# Altium schematic sheet MCU.SchDoc
size A3; Author: Ali Zoubir; Organization: ETML-ES; Address1: Avenue Recordon 1; Address2: 1004 Lausanne; Address3: Switzerland; Revision: 2221; SheetNumber: 2; SheetTotal: 6; SPICEModelCacheGNAZWADN: <root> / <DocumentId>GNAZWADN</DocumentId> / </root>; Version: V0
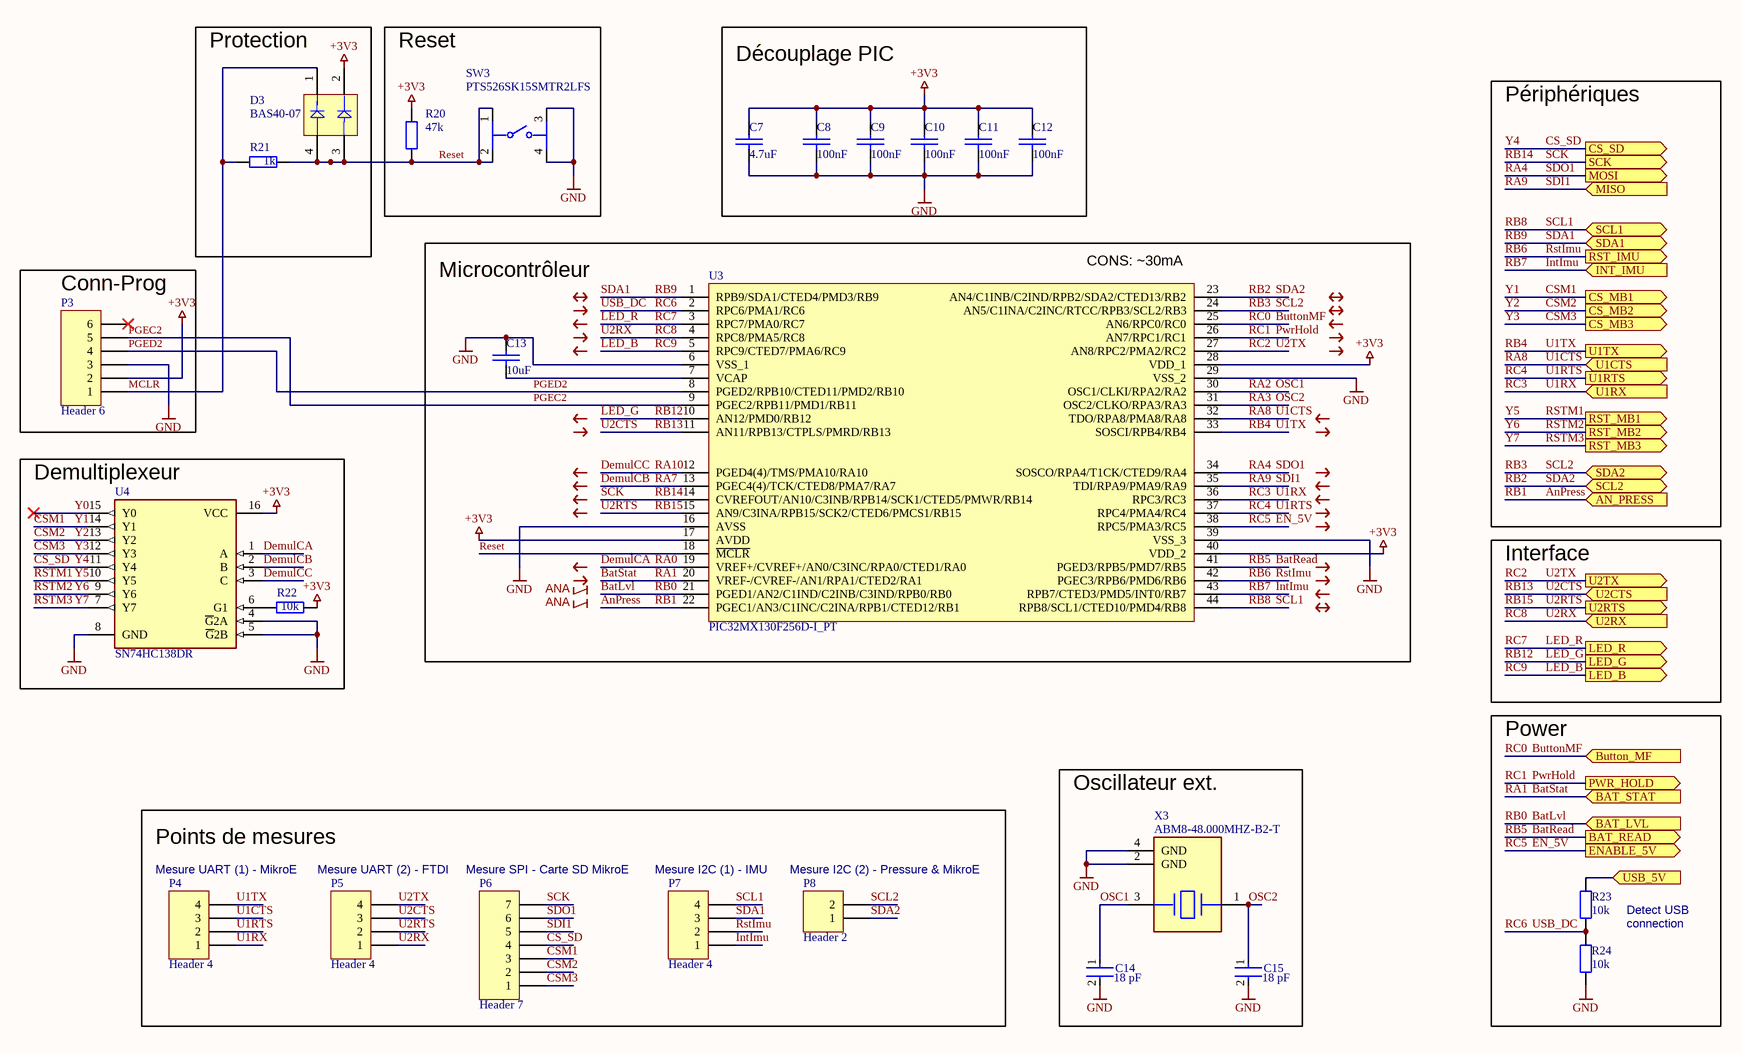
[diagram p0: MCU.SchDoc]

## Parts
C7  4.7uF  [6-0805_L]
C8  100nF  [6-0805_L]
C9  100nF  [6-0805_L]
C10  100nF  [6-0805_L]
C11  100nF  [6-0805_L]
C12  100nF  [6-0805_L]
C13  10uF  [6-0805_L]
C14  Capacitance: 18 pF  [FP-C0805C-DN-MFG]  (hidden comment: C0805C180J5GACTU)
C15  Capacitance: 18 pF  [FP-C0805C-DN-MFG]  (hidden comment: C0805C180J5GACTU)
D3  BAS40-07  [INF-SOT143_V]
P3  Header 6  [HDR1X6]
P4  Header 4  [HDR1X4]
P5  Header 4  [HDR1X4]
P6  Header 7  [HDR1X7]
P7  Header 4  [HDR1X4]
P8  Header 2  [HDR1X2]
R20  47k  [6-0805_L]
R21  1k  [6-0805_L]
R22  10k  [6-0805_L]
R23  10k  [6-0805_L]
R24  10k  [6-0805_L]
SW3  PTS526SK15SMTR2LFS  [FP-PTS526SK15SMTR2LFS-MFG]
U3  PIC32MX130F256D-I_PT  [QFP80P1200X1200X120-44N]
U4  SN74HC138DR  [FP-D0016A-IPC_A]
X3  ABM8-48.000MHZ-B2-T  [FP-ABM8-MFG]

## Blocks framed on the sheet
Protection: D3 R21
Reset: R20 SW3
Découplage PIC: C7-C12
Microcontrôleur: C13 U3
Conn-Prog: P3
Demultiplexeur: R22 U4
Power: R23 R24
Oscillateur ext.: C14 C15 X3
Points de mesures: P4-P8

## Ports
AN_PRESS (in), BAT_LVL (in), BAT_READ (out), BAT_STAT (in), Button_MF (in), CS_MB1 (out), CS_MB2 (out), CS_MB3 (out), CS_SD (out), ENABLE_5V (out), INT_IMU (in), LED_B (out), LED_G (out), LED_R (out), MISO (in), MOSI (out), PWR_HOLD (out), RST_IMU (out), RST_MB1 (out), RST_MB2 (out), RST_MB3 (out), SCK (out), SCL1 (bidir), SCL2 (bidir), SDA1 (bidir), SDA2 (bidir), U1CTS (in), U1RTS (out), U1RX (in), U1TX (out), U2CTS (in), U2RTS (out), U2RX (in), U2TX (out), USB_5V (in)

## Nets
+3V3: C7.1 C8.1 C9.1 C10.1 C11.1 C12.1 D3.2(K2) P3.2 R20.1 R22.2 U3.17(AVDD) U3.28(VDD_1) U3.40(VDD_2) U4.16(VCC)
GND: C7.2 C8.2 C9.2 C10.2 C11.2 C12.2 C13.1 C14.2 C15.2 P3.3 R24.1 SW3.3 SW3.4 U3.6(VSS_1) U3.16(AVSS) U3.29(VSS_2) U3.39(VSS_3) U4.4(~{G}2A) U4.5(~{G}2B) U4.8(GND) X3.2(GND) X3.4(GND)
AnPress: U3.22(PGEC1/AN3/C1INC/C2INA/RPB1/CTED12/RB1) ; port AN_PRESS  [also labelled RB1]
BatLvl: U3.21(PGED1/AN2/C1IND/C2INB/C3IND/RPB0/RB0) ; port BAT_LVL  [also labelled RB0]
BatRead: U3.41(PGED3/RPB5/PMD7/RB5) ; port BAT_READ  [also labelled RB5]
BatStat: U3.20(VREF-/CVREF-/AN1/RPA1/CTED2/RA1) ; port BAT_STAT  [also labelled RA1]
ButtonMF: U3.25(AN6/RPC0/RC0) ; port Button_MF  [also labelled RC0]
CS_SD: P6.4 U4.11(Y4) ; port CS_SD  [also labelled Y4]
CSM1: P6.3 U4.14(Y1) ; port CS_MB1  [also labelled Y1]
CSM2: P6.2 U4.13(Y2) ; port CS_MB2  [also labelled Y2]
CSM3: P6.1 U4.12(Y3) ; port CS_MB3  [also labelled Y3]
DemulCA: U3.19(VREF+/CVREF+/AN0/C3INC/RPA0/CTED1/RA0) U4.1(A)  [also labelled RA0]
DemulCB: U3.13(PGEC4(4)/TCK/CTED8/PMA7/RA7) U4.2(B)  [also labelled RA7]
DemulCC: U3.12(PGED4(4)/TMS/PMA10/RA10) U4.3(C)  [also labelled RA10]
EN_5V: U3.38(RPC5/PMA3/RC5) ; port ENABLE_5V  [also labelled RC5]
IntImu: P7.1 U3.43(RPB7/CTED3/PMD5/INT0/RB7) ; port INT_IMU  [also labelled RB7]
LED_B: U3.5(RPC9/CTED7/PMA6/RC9) ; port LED_B  [also labelled RC9]
LED_G: U3.10(AN12/PMD0/RB12) ; port LED_G  [also labelled RB12]
LED_R: U3.3(RPC7/PMA0/RC7) ; port LED_R  [also labelled RC7]
MCLR: D3.1(K1) P3.1 R21.1
OSC1: C14.1 U3.30(OSC1/CLKI/RPA2/RA2) X3.3  [also labelled RA2]
OSC2: C15.1 U3.31(OSC2/CLKO/RPA3/RA3) X3.1  [also labelled RA3]
PGEC2: P3.5 U3.9(PGEC2/RPB11/PMD1/RB11)
PGED2: P3.4 U3.8(PGED2/RPB10/CTED11/PMD2/RB10)
PwrHold: U3.26(AN7/RPC1/RC1) ; port PWR_HOLD  [also labelled RC1]
RA4: P6.6 U3.34(SOSCO/RPA4/T1CK/CTED9/RA4) ; port MOSI  [also labelled SDO1]
RA8: P4.3 U3.32(TDO/RPA8/PMA8/RA8) ; port U1CTS  [also labelled U1CTS]
RA9: P6.5 U3.35(TDI/RPA9/PMA9/RA9) ; port MISO  [also labelled SDI1]
RB2: P8.1 U3.23(AN4/C1INB/C2IND/RPB2/SDA2/CTED13/RB2) ; port SCL2  [also labelled SDA2]
RB3: P8.2 U3.24(AN5/C1INA/C2INC/RTCC/RPB3/SCL2/RB3) ; port SDA2  [also labelled SCL2]
RB4: P4.4 U3.33(SOSCI/RPB4/RB4) ; port U1TX  [also labelled U1TX]
RB6: P7.2 U3.42(PGEC3/RPB6/PMD6/RB6) ; port RST_IMU  [also labelled RstImu]
RB8: P7.4 U3.44(RPB8/SCL1/CTED10/PMD4/RB8) ; port SCL1  [also labelled SCL1]
RB9: P7.3 U3.1(RPB9/SDA1/CTED4/PMD3/RB9) ; port SDA1  [also labelled SDA1]
RB13: P5.3 U3.11(AN11/RPB13/CTPLS/PMRD/RB13) ; port U2CTS  [also labelled U2CTS]
RB14: P6.7 U3.14(CVREFOUT/AN10/C3INB/RPB14/SCK1/CTED5/PMWR/RB14) ; port SCK  [also labelled SCK]
RB15: P5.2 U3.15(AN9/C3INA/RPB15/SCK2/CTED6/PMCS1/RB15) ; port U2RTS  [also labelled U2RTS]
RC2: P5.4 U3.27(AN8/RPC2/PMA2/RC2) ; port U2TX  [also labelled U2TX]
RC3: P4.1 U3.36(RPC3/RC3) ; port U1RX  [also labelled U1RX]
RC4: P4.2 U3.37(RPC4/PMA4/RC4) ; port U1RTS  [also labelled U1RTS]
RC6: R23.1 R24.2 U3.2(RPC6/PMA1/RC6)  [also labelled USB_DC]
RC8: P5.1 U3.4(RPC8/PMA5/RC8) ; port U2RX  [also labelled U2RX]
Reset: D3.3(A2) D3.4(A1) R20.2 R21.2 SW3.1 SW3.2 U3.18(~{MCLR})
RSTM1: U4.10(Y5) ; port RST_MB1  [also labelled Y5]
RSTM2: U4.9(Y6) ; port RST_MB2  [also labelled Y6]
RSTM3: U4.7(Y7) ; port RST_MB3  [also labelled Y7]
USB_5V: R23.2 ; port USB_5V
Y0: U4.15(Y0)
NetC13_2: C13.2 U3.7(VCAP)
NetR22_1: R22.1 U4.6(G1)

Not connected (* = marked no-connect by the designer): P3 6*

## Notes on the sheet
- Périphériques
- (near U3) CONS: ~30mA
- Interface
- ANA
- (near P4) Mesure UART (1) - MikroE
- (near P5) Mesure UART (2) - FTDI
- (near P6) Mesure SPI - Carte SD MikroE
- (near P7) Mesure I2C (1) - IMU
- (near P8) Mesure I2C (2) - Pressure & MikroE
- Detect USB
- connection
- Fichier :
- a
- Date :
- Heure :
- Version :
- Auteur :
- Modif.
- b
- c
- d
- Projet :
- No :
- Nb feuilles
- Feuille n°
- Chemin :

## Library data of the parts
C7-C13 = C: SDTSourceLibName: C:\WINDOWS\TEMP\DA.LIB; PCB Footprint: RC0805
C14 C15 = CMP-2007-00302-2: CAP CER 18PF 50V C0G/NP0 0805; Manufacturer: KEMET; Temperature Characteristic: C0G; Tolerance: 0.05; Material: Ceramic; Temperature Coefficient: 30ppm/°C; Device Class L2: Capacitors; Temperature: -55°C to +125°C; Value: 18 pF; Package: C0805C-DN; Mouser Description: Cap Ceramic 18pF 50V C0G 5% SMD 0805 125C Paper T/R; Height: 0.88mm; ComponentLink2URL: https://content.kemet.com/datasheets/KEM_C1003_C0G_SMD.pdf; RoHS: TRUE; Octopart: https://octopart.com/c0805c180j5gactu-kemet-144810; ComponentLink2Description: Datasheet; Temperature Range High: +125°C; Digikey Description: CAP CER 18PF 50V C0G/NP0 0805; Device Class L1: Passive Components; Category: Cap; Automotive: No; Device Class L3: Ceramic Capacitors; Voltage Rating: 50 V; Temperature Range Low: -55°C; Ipc Land Pattern Name: CAPC200125X78; Lead Free: Yes; Manufacturer Part Number: C0805C180J5GACTU
D3 = CMP-1182-00009-1: Silicon Schottky Diode, -55 to 150 degC, SOT143, Reel, Green; Manufacturer: Infineon; VF (max): 1,000Â mV; CT (max): 5Â pF; VR (max): 40Â V; Green: TRUE; IF (max): 120Â mA; Configuration: Dual; ComponentLink1URL: http://www.infineon.com/; ComponentLink3URL: http://www.infineon.com/dgdl/SOT143-Package_Overview.pdf?folderId=db3a30431936bc4b011952ce8b1b3bed&fileId=db3a30431936bc4b011952df42203c0c; Packing: Reel; ComponentLink1Description: Manufacturer URL; Mounting Technology: Surface Mount; PartNumber: BAS40-07; ComponentLink2URL: http://www.infineon.com/dgdl/bas40_bas140series.pdf?folderId=db3a30431400ef68011425f1ca2505e3&fileId=db3a304314dca389011518a57ed20e11; PackageReference: SOT143; PackageDescription: 4-Pin Small Outline Transistor Package, 1.3 x 2.9 mm Body; ComponentLink2Description: Datasheet; ComponentLink3Description: Package Specification
P3 = Header 6: Header, 6-Pin; LatestRevisionDate: 17-Jul-2002; LatestRevisionNote: Re-released for DXP Platform.; Publisher: Altium Limited
P4 P5 P7 = Header 4: Header, 4-Pin; LatestRevisionDate: 17-Jul-2002; LatestRevisionNote: Re-released for DXP Platform.; Publisher: Altium Limited
P6 = Header 7: Header, 7-Pin; LatestRevisionDate: 17-Jul-2002; LatestRevisionNote: Re-released for DXP Platform.; Publisher: Altium Limited
P8 = Header 2: Header, 2-Pin; LatestRevisionDate: 17-Jul-2002; LatestRevisionNote: Re-released for DXP Platform.; Publisher: Altium Limited
R20 = Res2: Res 0805; Value: 1K; Published: 8-Jun-2000; LatestRevisionDate: 17-Jul-2002; LatestRevisionNote: Re-released for DXP Platform.; PackageReference: AXIAL-0.4; Publisher: Altium Limited; PackageDescription: Axial Device, Thru-Hole; 2 Leads; 0.4 in Pin Spacing
R21 R22 = Res2: Res 0805; Published: 8-Jun-2000; LatestRevisionDate: 17-Jul-2002; LatestRevisionNote: Re-released for DXP Platform.; PackageReference: AXIAL-0.4; Publisher: Altium Limited; PackageDescription: Axial Device, Thru-Hole; 2 Leads; 0.4 in Pin Spacing
  R21: Value: 1K
  R22: Value: 10k
R23 R24 = CMP-2001-04376-1: Res 0805; Manufacturer: Panasonic; Part Number: ERJ-6ENF1002V
SW3 = CMP-10040-000013-1: TACT 5.2 X 5.2, 1.5 MM H, 260GF,; Manufacturer: C&K; Operating Force: 250gf; Throw Configuration: SPST-NO; Contact Current Rating: 50mA; Standoff Height: 0mm; Contact Resistance: 100mΩ; Voltage Rating Dc: 12V; Electromechanical Life: 200000Cycles; Device Class L3: Tactile Switches; Device Class L2: Switches; Temperature: -20°C to +70°C; Temperature Range Low: -20°C; Package: PTS526SK15SMTR2LFS; Temperature Range High: +70°C; ComponentLink2Description: Datasheet; Device Class L1: Electromechanical; Height: 1.65mm; Digikey Description: TACT 5.2 X 5.2, 1.5 MM H, 260GF,; Category: Switch; RoHS: TRUE; Automotive: No; Lead Free: Yes; Manufacturer Part Number: PTS526SK15SMTR2LFS; Octopart: https://octopart.com/pts526+sk15+smtr2+lfs-c%26k+components-100617999; ComponentLink2URL: https://www.ckswitches.com/media/2780/pts526.pdf
U3 = PIC32MX130F256D-I_PT: Microchip PIC32MX130F256D-I/PT, 32bit PIC Microcontroller, 40MHz, 256 kB Flash, 44-Pin TQFP; Geometry.Height: 1.2mm; Mouser Part Number: 579-MX130F256DIPT; Mouser Price/Stock: https://www.mouser.co.uk/ProductDetail/Microchip-Technology/PIC32MX130F256D-I-PT?qs=XR%2FfMt4sL%252BEhDQElh0Q%2FjQ%3D%3D; Manufacturer_Name: Microchip; Manufacturer_Part_Number: PIC32MX130F256D-I/PT; Datasheet Link: https://componentsearchengine.com/Datasheets/5/PIC32MX130F256D-I_PT.pdf
U4 = CMP-1633-00238-3: IC 3-8 LINE DECOD/DEMUX 16-SOIC; Number of Elements: 1; Number of Output Lines: 8; Number of Inputs: 3; Logic Function: Demultiplexer; Polarity: Inverting; Max Frequency: 28MHz; Quiescent Current: 8uA; Propagation Delay: 225ns; High Level Output Current: -5.2mA; Supply Type: Single; Max Supply Voltage: 6V; Operating Supply Voltage: 5V; Low Level Output Current: 5.2mA; Max Power Dissipation: 320mW; Min Supply Voltage: 2V; Number of Pins: 16; RoHS Compliant: Yes; Number of Bits: 8; Length: 9.9mm; Case/Package: SOIC; Max Operating Temperature: 85°C; Number of Channels: 1; Radiation Hardening: No; Package Quantity: 2500; Number of Input Lines: 3; Max Supply Current: 8uA; REACH SVHC: No SVHC; Number of Outputs: 8; Independent Circuits: 1; Bandwidth: 28MHz; Number of Circuits: 1; Width: 3.91mm; Contact Plating: Gold; Packaging: Tape and Reel; Min Operating Temperature: -40°C; Lead Free: Lead Free; Height: 1.58mm; Weight: 0.004998oz; Mount: Surface Mount; Turn-On Delay Time: 225ns
X3 = CMP-27762-011708-1: Crystal 48MHz ±20ppm 18pF SMD-4 3.2mm x 2.5mm; Series Resistance: 35R; Frequency Stability: 50ppm; Package Quantity: 1000; Packaging: Tape and Reel; Mount: Surface Mount; Length: 3.2mm; Load Capacitance: 18pF; Max Operating Temperature: 70°C; Operating Frequency: 48 MHz; RoHS Compliant: Yes; Series: ABM8; Frequency Tolerance: 20ppm; Lead Free: Lead Free; Min Operating Temperature: -20°C; Case/Package: CSMD; Number of Pins: 4; Height: 0.031inch; ESR (Equivalent Series Resistance): 35R; Frequency: 48MHz; Radiation Hardening: No; Width: 0.098inch; Tolerance: 20ppm; Termination: SMD/SMT; Depth: 2.5mm; Resistor Type: Ceramic; REACH SVHC: No SVHC